# EAGLE design small_analyzer (EAGLE 6.4)
DATABASE: ~/research/analoglab/asthma/eagle/digikeydb.txt
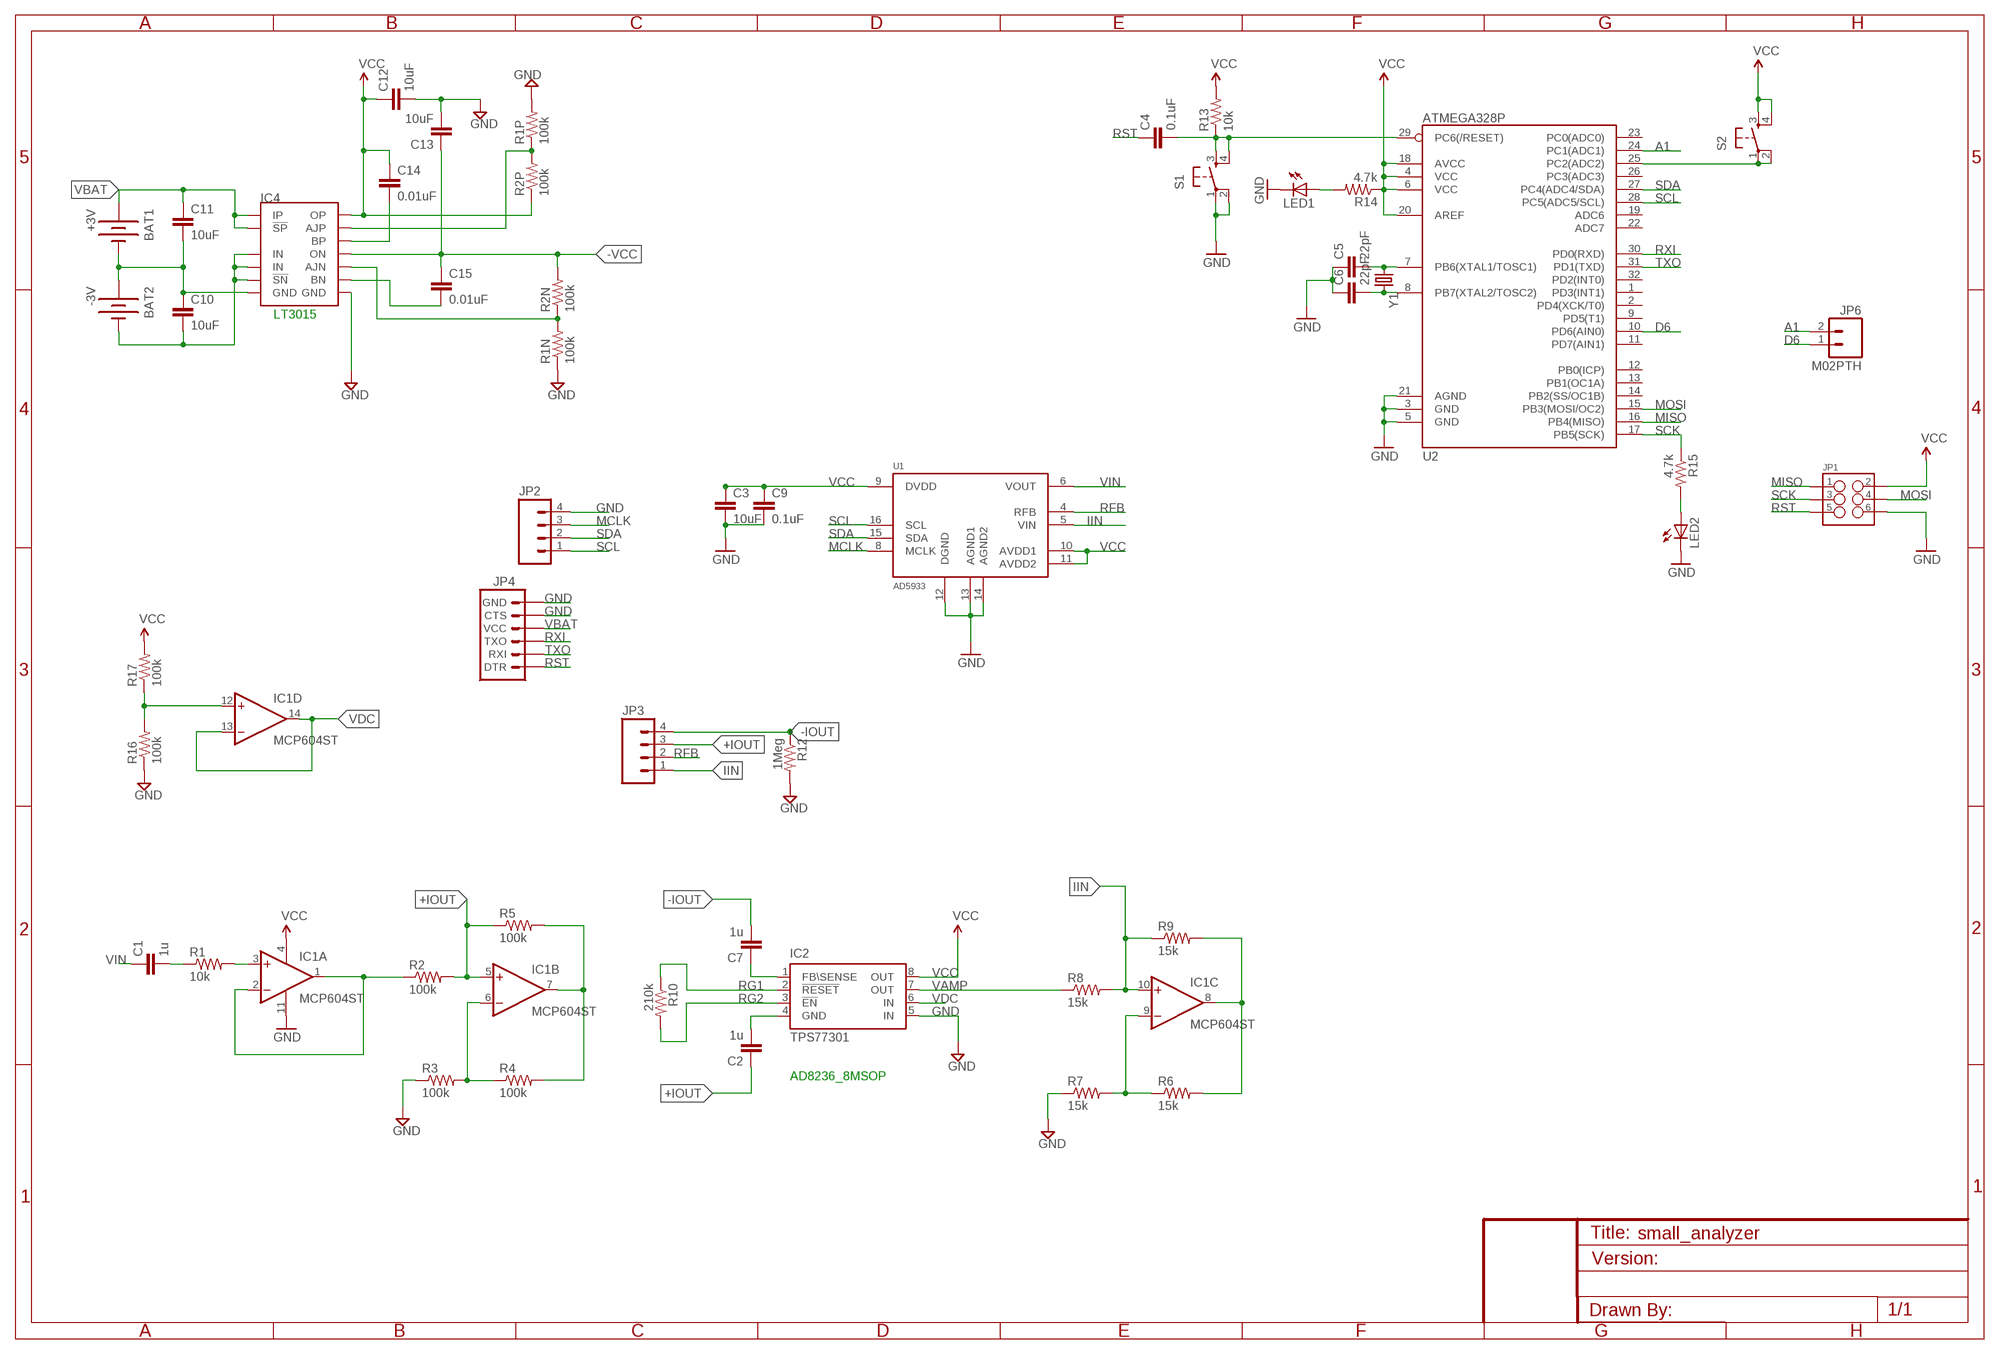
[diagram p0: schematic, sheet 1]

## Parts
BAT1  +3V  BATTERY12MM  [BATTCON_12MM]
BAT2  -3V  BATTERY12MM  [BATTCON_12MM]
C1  1u  CAP0603-CAP  [0603-CAP]
C2  1u  CAP0603-CAP  [0603-CAP]
C3  10uF  CAP0603-CAP  [0603-CAP]
C4  0.1uF  CAP0805  [0805]
C5  22pF  CAP0805  [0805]
C6  22pF  CAP0805  [0805]
C7  1u  CAP0603-CAP  [0603-CAP]
C9  0.1uF  CAP0603-CAP  [0603-CAP]
C10  10uF  CAP0603-CAP  [0603-CAP]
C11  10uF  CAP0603-CAP  [0603-CAP]
C12  10uF  CAP0603-CAP  [0603-CAP]
C13  10uF  CAP0603-CAP  [0603-CAP]
C14  0.01uF  CAP0603-CAP  [0603-CAP]
C15  0.01uF  CAP0603-CAP  [0603-CAP]
IC1  MCP604ST  [TSSOP14]
IC2  TPS77301  [SOP-08]
IC4  LT3032  [DFN14-4X3DE]
JP1  M03X2NO_SILK  [2X3-NS]
JP2  M04PTH  [1X04]
JP3  M04PTH  [1X04]
JP4  ARDUINO_SERIAL_PROGRAMLOCK  [1X06_LOCK]
JP6  M02PTH  [1X02]
LED1  LED0603  [LED-0603]
LED2  LED0603  [LED-0603]
R1  10k  RESISTOR0603-RES  [0603-RES]
R1N  100k  RESISTOR0805-RES  [0805]
R1P  100k  RESISTOR0805-RES  [0805]
R2  100k  RESISTOR0603-RES  [0603-RES]
R2N  100k  RESISTOR0805-RES  [0805]
R2P  100k  RESISTOR0805-RES  [0805]
R3  100k  RESISTOR0603-RES  [0603-RES]
R4  100k  RESISTOR0603-RES  [0603-RES]
R5  100k  RESISTOR0603-RES  [0603-RES]
R6  15k  RESISTOR0603-RES  [0603-RES]
R7  15k  RESISTOR0603-RES  [0603-RES]
R8  15k  RESISTOR0603-RES  [0603-RES]
R9  15k  RESISTOR0603-RES  [0603-RES]
R10  210k  RESISTOR0603-RES  [0603-RES]
R12  1Meg  RESISTOR0603-RES  [0603-RES]
R13  10k  RESISTOR0805-RES  [0805]
R14  4.7k  RESISTOR0805-RES  [0805]
R15  4.7k  RESISTOR0805-RES  [0805]
R16  100k  RESISTOR0805-RES  [0805]
R17  100k  RESISTOR0805-RES  [0805]
S1  TAC_SWITCHSMD  [TACTILE_SWITCH_SMD]
S2  TAC_SWITCHSMD  [TACTILE_SWITCH_SMD]
U1  AD5933  [SSOP16]
U2  ATMEGA328P  ATMEGA328_SMT  [TQFP32-08]
Y1  CRYSTAL5X3  [CRYSTAL-SMD-5X3]

## Nets
+IOUT: C2.1 IC1.5(B:+IN) JP3.3 R2.2 R5.1
-IOUT: C7.2 JP3.4 R12.1
-VCC: C13.1 C15.1 IC4.7(ON) R2N.2
A1: JP6.2 U2.24(PC1(ADC1))
D6: JP6.1 U2.10(PD6(AIN0))
GND: C3.2 C5.1 C6.1 C9.2 C12.2 C13.2 IC1.11(P:V-) IC2.5(IN) IC4.5(GND) JP1.6 JP2.4 JP4.5(CTS) JP4.6(GND) LED1.C LED2.C R1N.1 R1P.2 R3.1 R7.1 R12.2 R16.1 S1.1 S1.2 U1.12(DGND) U1.13(AGND1) U1.14(AGND2) U2.3(GND) U2.5(GND) U2.21(AGND)
IIN: IC1.10(C:+IN) JP3.1 R8.2 R9.1 U1.5(VIN)
MCLK: JP2.3 U1.8(MCLK)
MISO: JP1.1 U2.16(PB4(MISO))
MOSI: JP1.4 U2.15(PB3(MOSI/OC2))
N$1: C1.2 R1.1
N$2: IC1.3(A:+IN) R1.2
N$3: IC1.1(A:OUT) IC1.2(A:-IN) R2.1
N$4: C5.2 U2.7(PB6(XTAL1/TOSC1)) Y1.1
N$5: IC1.6(B:-IN) R3.2 R4.1
N$6: IC1.7(B:OUT) R4.2 R5.2
N$7: IC1.8(C:OUT) R6.2 R9.2
N$8: IC1.9(C:-IN) R6.1 R7.2
N$9: C6.2 U2.8(PB7(XTAL2/TOSC2)) Y1.3
N$10: LED2.A R15.2
N$11: C4.2 R13.1 S1.3 S1.4 U2.29(PC6(/RESET))
N$12: LED1.A R14.2
N$14: BAT1.GND(-) BAT2.PWR@1(+) C10.1 C11.2 IC4.4(GND)
N$15: IC1.12(D:+IN) R16.2 R17.1
N$16: S2.1 S2.2 U2.25(PC2(ADC2))
N$19: BAT2.GND(-) C10.2 IC4.6(IN) IC4.9(IN) IC4.10(!SN)
N$20: C14.2 IC4.3(BP)
N$21: C15.2 IC4.11(BN)
N$22: IC4.8(AJN) R1N.2 R2N.1
N$23: IC4.2(AJP) R1P.1 R2P.2
N$24: C7.1 IC2.1(FB\SENSE)
N$25: C2.2 IC2.4(GND)
RFB: JP3.2 U1.4(RFB)
RG1: IC2.2(!RESET) R10.1
RG2: IC2.3(!EN) R10.2
RST: C4.1 JP1.5 JP4.1(DTR)
RXI: JP4.3(TXO) U2.30(PD0(RXD))
SCK: JP1.3 R15.1 U2.17(PB5(SCK))
SCL: JP2.1 U1.16(SCL) U2.28(PC5(ADC5/SCL))
SDA: JP2.2 U1.15(SDA) U2.27(PC4(ADC4/SDA))
TXO: JP4.2(RXI) U2.31(PD1(TXD))
VAMP: IC2.7(OUT) R8.1
VBAT: BAT1.PWR@1(+) C11.1 IC4.12(!SP) IC4.14(IP) JP4.4(VCC)
VCC: C3.1 C9.1 C12.1 C14.1 IC1.4(P:V+) IC2.8(OUT) IC4.1(OP) JP1.2 R2P.1 R13.2 R14.1 R17.2 S2.3 S2.4 U1.9(DVDD) U1.10(AVDD1) U1.11(AVDD2) U2.4(VCC) U2.6(VCC) U2.18(AVCC) U2.20(AREF)
VDC: IC1.13(D:-IN) IC1.14(D:OUT) IC2.6(IN)
VIN: C1.1 U1.6(VOUT)
Unconnected: U2.1(PD3(INT1)) U2.2(PD4(XCK/T0)) U2.9(PD5(T1)) U2.11(PD7(AIN1)) U2.12(PB0(ICP)) U2.13(PB1(OC1A)) U2.14(PB2(SS/OC1B)) U2.19(ADC6) U2.22(ADC7) U2.23(PC0(ADC0)) U2.26(PC3(ADC3)) U2.32(PD2(INT0))

## Notes on the sheet
- LT3015
- AD8236_8MSOP

## Library data of the parts
BAT1 BAT2 = SparkFun-Electromechanical:BATTERY: Battery Holders Various common sizes : AA, AAA, 20mm coin cell and 12mm coin cell. 20MM_4LEGS, BATT-10373
C1-C7 C9-C15 = SparkFun-Passives:CAP: Capacitor Standard 0603 ceramic capacitor, and 0.1" leaded capacitor.
IC1 = linear:MCP604: Quad Op Amp 2.7V to 6.0V Single Supply CMOS Source: http://ww1.microchip.com/downloads/en/DeviceDoc/21314g.pdf
IC2 = texas:TPS773*: 250-mA LDO REGULATORS WITH RESET OUTPUT WITH 8-PIN MSOP PACKAGING Source: http://focus.ti.com/lit/ds/symlink/tps77333.pdf; MF: TEXAS INSTRUMENT CONNECTORS; MPN: TPS77301DGK; OC_FARNELL: 1510194; OC_NEWARK: 77C1213
IC4 = AWJLEagleLib:LT3032: LT3032 dual postive/negative LDO linear regulator
JP1 = SparkFun-Connectors:M03X2: 2x3 .1" header. Shrouded, with keying- CONN-10681 SMT- CONN-11415 Pogo pins- HW-11044
JP2 JP3 = SparkFun-Connectors:M04: Header 4 Standard 4-pin 0.1" header. Use with straight break away headers (SKU : PRT-00116), right angle break away headers (PRT-00553), swiss pins (PRT-00743), machine pins (PRT-00117), and female headers (PRT-00115). Molex polarized connector foot print use with SKU : PRT-08231 with associated crimp pins and housings. 1MM SMD Version SKU: PRT-10208
JP4 = SparkFun-Connectors:ARDUINO_SERIAL_PROGRAM: FTDI connector footprints
JP6 = SparkFun-Connectors:M02: Standard 2-pin 0.1" header. Use with - straight break away headers ( PRT-00116) - right angle break away headers (PRT-00553) - swiss pins (PRT-00743) - machine pins (PRT-00117) - female headers (PRT-00115) Molex polarized connector foot print use with: PRT-08233 with associated crimp pins and housings. 2.54_SCREWTERM for use with PRT-10571. 3.5mm Screw Terminal footprints for PRT-08084 5mm Screw Terminal footprints for use with PRT-08433
LED1 LED2 = SparkFun-LED:LED: LEDs Standard schematic elements and footprints for 5mm, 3mm, 1206, and 0603 sized LEDs. 5mm - Spark Fun Electronics SKU : COM-00529 (and others)
R1 R1N R1P R2 R2N R2P R3-R10 R12-R17 = SparkFun-Passives:RESISTOR: Resistor Basic schematic elements and footprints for 0603, 1206, and PTH resistors.
S1 S2 = SparkFun-Electromechanical:TAC_SWITCH: Momentary Switch Button commonly used for reset or general input. Spark Fun Electronics SKU : COM-00097 SMT- SWCH-08247; PROD_ID: SWCH-08247
U1 = kblom:AD5933: 1 MSPS, 12-Bit Impedance Converter, Network Analyzer Applications: Electrochemical analysis Bioelectrical impedance analysis Impedance spectroscopy Complex impedance measurement Corrosion monitoring and protection equipment Biomedical and automotive sensors Proximity sensing Nondestructive testing Material property analysis Fuel/battery cell condition monitoring source <http://www.analog.com/static/imported-files/data_sheets/AD5933.pdf>
U2 = SparkFun-DigitalIC:ATMEGA328_SMT: 32-Pin Atmega328 part Commonly used on Arduino compatible boards Available in QFP and QFN packages TQFP is IC-09069 QFN is non-stock; PROD_ID: IC-09069
Y1 = SparkFun-FreqCtrl:CRYSTAL: Various standard crystals. Proven footprints. Spark Fun Electronics SKU : COM-00534

## Net classes
0 default: width 0.305 mm, drill 0.508 mm, clearance 0.254 mm

## Board
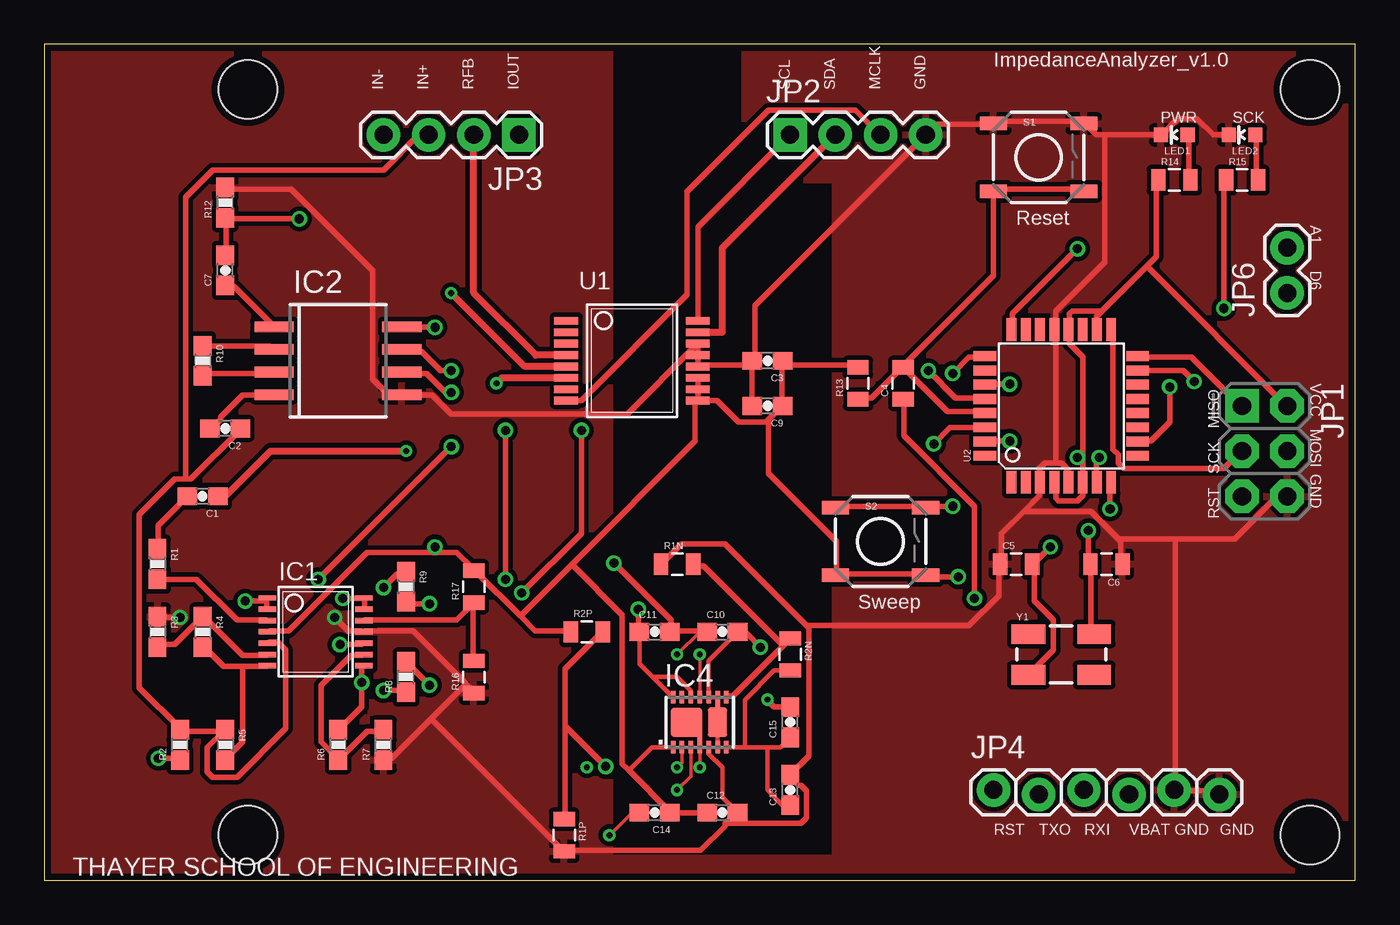
[diagram p1: board, top side]
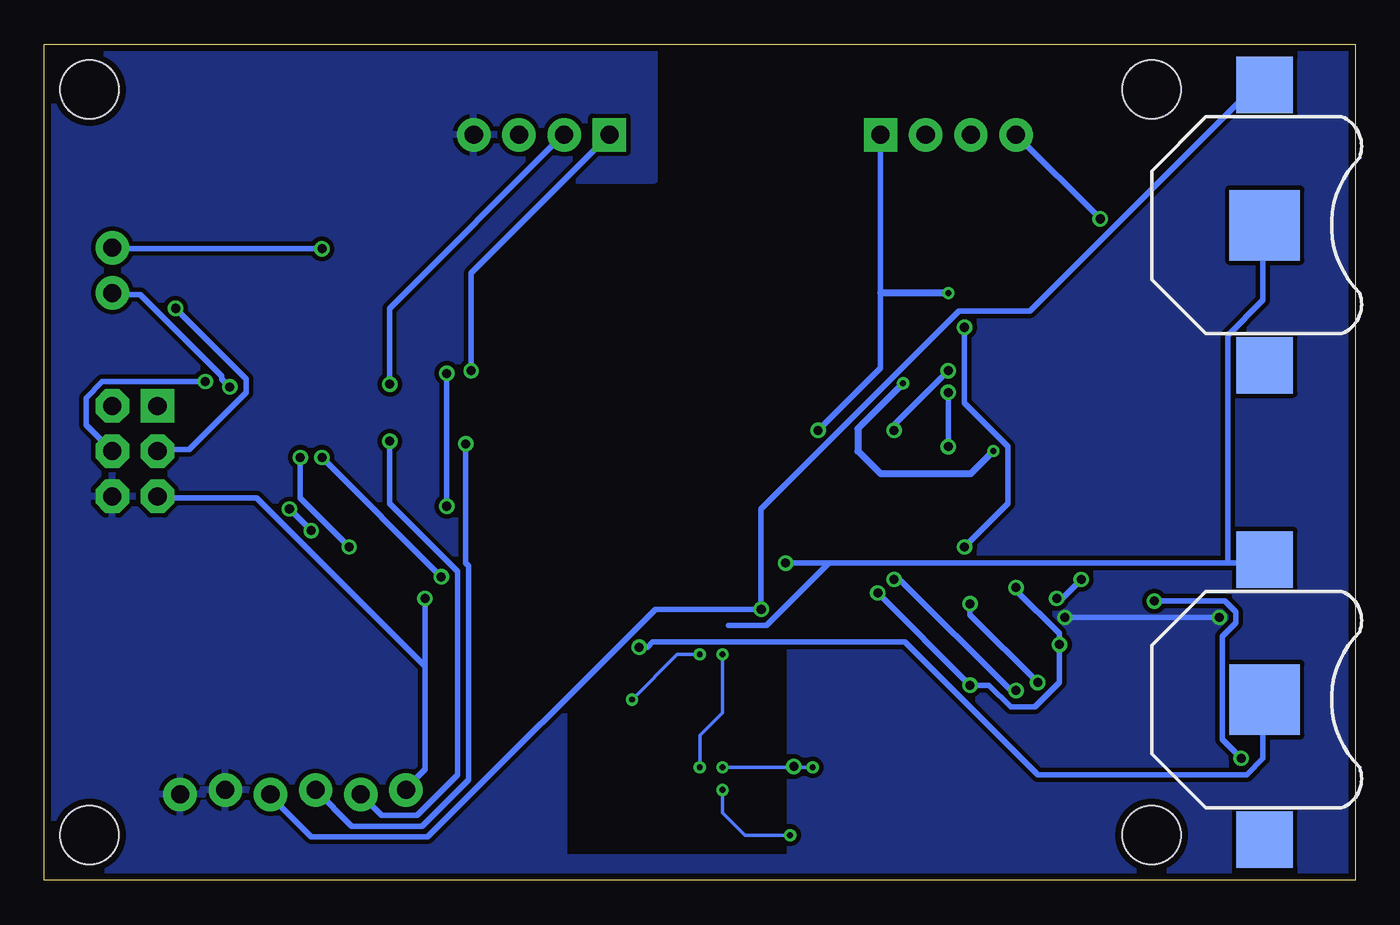
[diagram p2: board, bottom side, seen from below]

Size 73.66 x 46.99 mm. Coordinates in mm from the lower left corner, seen from the top.
Outline: 0,0 73.66,0 73.66,46.99 0,46.99 0,0
Copper layers (1*16): Top 0.0356mm / dielectric 1.5011mm / Bottom 0.0356mm
Design rules "LaenPCBOrder": minimum track width 6mil, minimum drill 13mil, track to track 6mil, track to pad 6mil, pad to pad 6mil, via to via 6mil, smd to smd 6mil, copper to edge 15mil, drill to drill 6mil, minimum pad ring 7mil, minimum via ring 7mil, stop-mask expansion 3mil, vias tented up to drill 0mil, thermal gap 10mil

### Footprints (pad centres in the part's own frame; a part is rotated, then mirrored left to right if it is on the bottom)
BATTCON_12MM = smd 3.962 x 3.962: GND 0,0 | smd 3.175 x 3.175: PWR@1 -7.874,0; PWR@2 7.874,0
0603-CAP = smd 1.1 x 1: 1 -0.85,0; 2 0.85,0
0805 = smd 0.8 x 1.2: 1 -0.9,0; 2 0.9,0
TSSOP14 = smd 0.305 x 0.991: 1 -1.905,-2.718; 2 -1.27,-2.718; 3 -0.635,-2.718; 4 0,-2.718; 5 0.635,-2.718; 6 1.27,-2.718; 7 1.905,-2.718; 8 1.905,2.718; 9 1.27,2.718; 10 0.635,2.718; 11 0,2.718; 12 -0.635,2.718; 13 -1.27,2.718; 14 -1.905,2.718
SOP-08 = smd 0.6 x 2.2: 1 -1.905,-3.6; 2 -0.635,-3.6; 3 0.635,-3.6; 4 1.905,-3.6; 5 1.905,3.575; 6 0.635,3.575; 7 -0.635,3.575; 8 -1.905,3.575
DFN14-4X3DE = smd 0.25 x 0.7: 1 -1.5,-1.4; 2 -1,-1.4; 3 -0.5,-1.4; 5 0.5,-1.4; 6 1,-1.4; 7 1.5,-1.4; 8 1.5,1.4; 10 0.5,1.4; 11 0,1.4; 12 -0.5,1.4; 13 -1,1.4; 14 -1.5,1.4 | smd 0.25 x 2: 4 0,-0.75; 9 1,0.75 | smd 1.75 x 1.65: 4@1 -0.75,0 | smd 1.07 x 1.65: 9@2 1,0
2X3-NS = drill 1.016 pad 1.88 square: 1 -2.54,-1.27 | drill 1.016 pad 1.88 octagon: 2 -2.54,1.27; 3 0,-1.27; 4 0,1.27; 5 2.54,-1.27; 6 2.54,1.27
1X04 = drill 1.016 pad 1.88 square: 1 0,0 | drill 1.016 pad 1.88: 2 2.54,0; 3 5.08,0; 4 7.62,0
1X06_LOCK = drill 1.016 pad 1.88: 1 0,0; 2 2.54,-0.254; 3 5.08,0; 4 7.62,-0.254; 5 10.16,0; 6 12.7,-0.254
1X02 = drill 1.016 pad 1.88: 1 0,0; 2 2.54,0
LED-0603 = smd 0.8 x 0.8: A 0,-0.75; C 0,0.75
0603-RES = smd 1.1 x 1: 1 -0.85,0; 2 0.85,0
TACTILE_SWITCH_SMD = smd 1.524 x 0.762: 1 -2.54,1.905; 2 2.54,1.905; 3 -2.54,-1.905; 4 2.54,-1.905
SSOP16 = smd 0.44 x 1.34: 1 -2.24,-3.7; 2 -1.6,-3.7; 3 -0.96,-3.7; 4 -0.32,-3.7; 5 0.32,-3.7; 6 0.96,-3.7; 7 1.6,-3.7; 8 2.24,-3.7; 9 2.24,3.7; 10 1.6,3.7; 11 0.96,3.7; 12 0.32,3.7; 13 -0.32,3.7; 14 -0.96,3.7; 15 -1.6,3.7; 16 -2.24,3.7
TQFP32-08 = smd 1.27 x 0.559: 1 -4.293,2.8; 2 -4.293,2; 3 -4.293,1.2; 4 -4.293,0.4; 5 -4.293,-0.4; 6 -4.293,-1.2; 7 -4.293,-2; 8 -4.293,-2.8; 17 4.293,-2.8; 18 4.293,-2; 19 4.293,-1.2; 20 4.293,-0.4; 21 4.293,0.4; 22 4.293,1.2; 23 4.293,2; 24 4.293,2.8 | smd 0.559 x 1.27: 9 -2.8,-4.293; 10 -2,-4.293; 11 -1.2,-4.293; 12 -0.4,-4.293; 13 0.4,-4.293; 14 1.2,-4.293; 15 2,-4.293; 16 2.8,-4.293; 25 2.8,4.293; 26 2,4.293; 27 1.2,4.293; 28 0.4,4.293; 29 -0.4,4.293; 30 -1.2,4.293; 31 -2,4.293; 32 -2.8,4.293
STAND-OFF = hole 3.302: 0,0
CRYSTAL-SMD-5X3 = smd 1.9 x 1.1: 1 -1.85,-1.15; 2 1.85,-1.15; 3 1.85,1.15; 4 -1.85,1.15

### Placement (x,y rotation side)
BAT1  5.08,36.83 270 bottom
BAT2  5.08,10.16 270 bottom
C1  8.89,21.59 180 top
C2  10.16,25.4 180 top
C3  40.64,29.21 180 top
C4  48.26,27.94 90 top
C5  54.61,17.78 0 top
C6  59.69,17.78 180 top
C7  10.16,34.29 90 top
C9  40.64,26.67 180 top
C10  38.1,13.97 0 top
C11  34.29,13.97 0 top
C12  38.1,3.81 0 top
C13  41.91,5.08 90 top
C14  34.29,3.81 180 top
C15  41.91,8.89 90 top
IC1  15.24,13.97 270 top
IC2  16.51,29.21 270 top
IC4  36.83,8.89 0 top
JP1  68.58,24.13 270 top
JP2  41.91,41.91 0 top
JP3  26.67,41.91 180 top
JP4  53.34,5.08 0 top
JP6  69.85,33.02 90 top
LED1  63.5,41.91 90 top
LED2  67.31,41.91 90 top
R1  6.35,17.78 270 top
R1N  35.56,17.78 0 top
R1P  29.21,2.54 270 top
R2  7.62,7.62 90 top
R2N  41.91,12.7 270 top
R2P  30.48,13.97 0 top
R3  6.35,13.97 270 top
R4  8.89,13.97 270 top
R5  10.16,7.62 270 top
R6  16.51,7.62 90 top
R7  19.05,7.62 90 top
R8  20.32,11.43 90 top
R9  20.32,16.51 270 top
R10  8.89,29.21 270 top
R12  10.16,38.1 90 top
R13  45.72,27.94 90 top
R14  63.5,39.37 0 top
R15  67.31,39.37 0 top
R16  24.13,11.43 90 top
R17  24.13,16.51 90 top
S1  55.88,40.64 0 top
S2  46.99,19.05 0 top
U1  33.02,29.21 270 top
U2  57.15,26.67 90 top
U$1  [STAND-OFF]  11.43,44.45 0 top
U$2  [STAND-OFF]  11.43,2.54 0 top
U$3  [STAND-OFF]  71.12,2.54 0 top
U$4  [STAND-OFF]  71.12,44.45 0 top
Y1  57.15,12.7 0 top

### Tracks (layer width: path | path; a pad name or v marks a point on that pad's centre or on a via)
+IOUT
  Top 0.305: IC1.5 12.65,13.41 13.11,13.41 13.56,12.95 13.56,8.53 10.82,5.79 9.45,5.79 9.14,6.1 9.14,7.47 10.06,8.38 R5.1 9.91,8.38 7.62,8.38 R2.2 7.62,8.53 5.33,10.82 5.33,20.57 7.32,22.55 7.92,22.55 | 7.92,22.55 8.23,22.55 10.97,25.3 C2.1 | JP3.3 21.03,41.91 19.05,39.93 9.45,39.93 7.92,38.41 7.92,22.55
-IOUT  (via drill 0.51)
  Top 0.305: C7.2 10.21,35.2 10.21,37.19 R12.1 10.36,37.19 v14.33,37.19
  Bottom 0.305: JP3.4 v14.33,37.19
-VCC
  Top 0.254: IC4.7 39.37,7.49 | 39.37,7.49 40.64,7.49 | 40.64,7.49 41.36,7.49 C15.1 | R2N.2 41.01,11.8 39.37,10.16 39.37,7.49 | C13.1 41.49,4.23 40.64,5.08 40.64,7.49
A1  (via drill 0.51)
  Top 0.305: v58.06,35.51 54.41,31.85 54.41,31.09 U2.24
  Bottom 0.305: v58.06,35.51 69.8,35.51 JP6.2
D6  (via drill 0.51)
  Top 0.305: v63.25,27.74 63.25,25.76 62.18,24.69 61.57,24.69 U2.10
  Bottom 0.305: v63.25,27.74 63.7,28.19 63.7,28.35 68.28,32.92 69.8,32.92 JP6.1
GND  (via drill 0.51)
  Top 0.254: IC4.5 37.33,7.12 38.1,6.35 38.1,4.66 C12.2
  Top 0.305: R12.2 10.21,38.86 13.87,38.86 18.44,34.29 18.44,28.19 19.2,27.43 19.96,27.43 IC2.5 20.12,27.28 21.79,27.28 22.86,26.21 32.77,26.21 36.58,30.02 U1.14 36.73,30.02 36.73,29.57 U1.13 36.73,29.41 36.73,28.96 U1.12 36.88,28.96 39.78,28.96 | 59.59,41.91 59.13,41.91 58.52,42.52 S1.2 58.37,42.67 53.34,42.67 S1.1 53.34,42.52 50.14,42.52 JP2.4 39.93,32.31 39.93,29.26 C3.2 | 59.59,41.91 LED1.C 62.79,41.91 63.7,42.82 64.77,42.82 65.68,41.91 LED2.C | 39.78,28.96 39.78,29.11 C3.2 | 39.78,28.96 39.78,26.67 C9.2 | 39.78,28.96 C3.2 | 23.7,11.05 24.08,10.67 R16.1 24.23,10.52 | 23.7,11.05 20.73,14.02 17.98,14.02 IC1.11 17.83,14.02 17.07,14.02 v16.31,14.78 | v7.62,14.78 6.4,14.78 R3.1 | 23.7,11.05 21.72,9.07 | 21.72,9.07 19.51,6.86 19.05,6.86 R7.1 | JP4.6 65.84,5.03 63.55,5.03 JP4.5 63.55,5.18 63.55,19.2 | 55.09,20.8 55.93,21.64 55.93,22.25 U2.3 55.93,22.4 55.93,23.16 56.24,23.47 56.84,23.47 | 55.09,20.8 53.8,19.51 53.8,17.83 C5.1 53.65,17.68 53.65,16 51.97,14.33 42.98,14.33 42.9,14.25 | 60.43,19.13 58.83,20.73 55.17,20.73 55.09,20.8 | 60.43,19.13 60.5,19.05 60.5,17.83 C6.1 | 56.84,23.47 57.15,23.47 57.45,23.16 57.45,22.4 U2.5 | 56.84,23.47 56.84,30.94 U2.21 56.84,31.09 56.84,32 59.59,34.75 59.59,41.91 | 63.55,19.2 60.5,19.2 60.43,19.13 | 63.55,19.2 66.9,19.2 69.19,21.49 69.8,21.49 JP1.6 | 38.33,3.28 38.25,3.2 38.25,3.05 36.88,1.68 29.26,1.68 R1P.2 29.11,1.68 21.72,9.07 | 38.33,3.28 38.86,3.81 C12.2 | 38.33,3.28 38.41,3.2 42.52,3.2 42.82,3.5 42.82,5.03 42.52,5.33 42.37,5.33 41.91,5.79 C13.2 41.91,5.94 42.98,7.01 42.98,14.17 42.9,14.25 | 42.9,14.25 38.25,18.9 35.81,18.9 34.75,17.83 R1N.1
  Bottom 0.305: v16.31,14.78 v7.62,14.78
  pour Bottom: 0,46.99 30.48,46.99 31.75,46.99 31.75,1.27 44.45,1.27 44.45,39.37 39.37,39.37 39.37,46.99 73.66,46.99 73.66,0 0,0
  pour Top: 0,46.99 31.75,46.99 31.75,1.27 44.45,1.27 44.45,39.37 39.37,39.37 39.37,46.99 73.66,46.99 73.66,0 0,0
IIN  (via drill 0.33, 0.51)
  Top 0.305: v16.61,13.26 17.83,13.26 IC1.10 | v19.05,16.46 19.81,17.22 20.27,17.22 R9.1 | v21.64,10.97 20.42,12.19 R8.2 | v30.18,25.3 30.18,19.51 v26.82,16.15
  Top 0.406: U1.5 26.99,28.89 v22.86,33.02
  Bottom 0.305: v19.05,16.46 19.05,16.31 16.61,13.87 v16.61,13.26 16.61,11.12 17.98,9.75 19.36,9.75 20.57,10.97 v21.64,10.97 v26.82,16.15 | JP3.1 26.67,33.02 26.67,28.8 v30.18,25.3
  Bottom 0.406: v22.86,33.02 26.67,33.02
MCLK
  Top 0.305: U1.8 29.41,26.98 30.18,26.98 36.12,32.92 36.12,38.71 40.69,43.28 45.57,43.28 46.94,41.91 JP2.3
MISO
  Top 0.305: U2.16 61.57,29.41 64.47,29.41 67.21,26.67 JP1.1
MOSI  (via drill 0.51)
  Top 0.305: v64.62,28.04 64.01,28.65 61.57,28.65 U2.15
  Bottom 0.305: v64.62,28.04 70.41,28.04 71.32,27.13 71.32,25.6 JP1.4
N$1
  Top 0.305: R1.1 6.4,18.75 6.4,19.96 7.92,21.49 C1.2
N$2
  Top 0.305: IC1.3 12.5,14.63 10.82,14.63 8.53,16.92 6.4,16.92 R1.2
N$3  (via drill 0.51)
  Top 0.305: 12.5,15.7 12.5,15.85 IC1.1 | 12.5,15.7 12.5,15.24 IC1.2 | v6.4,6.86 7.62,6.86 R2.1 | 12.5,15.7 v11.28,15.7
  Bottom 0.305: v6.4,6.86 7.47,7.92 7.47,13.72 6.71,14.48 6.71,15.09 7.32,15.7 v11.28,15.7
N$4  (via drill 0.51)
  Top 0.305: Y1.1 55.32,11.58 56.69,12.95 56.69,14.63 55.63,15.7 55.63,17.68 C5.2 55.63,17.83 v56.54,18.75 | v59.28,23.77 59.13,23.62 59.13,22.4 U2.7
  Bottom 0.305: v59.28,23.77 59.28,21.49 v56.54,18.75
N$5
  Top 0.305: IC1.6 12.5,12.65 11.12,12.65 8.99,14.78 R4.1 8.84,14.78 7.32,13.26 6.4,13.26 R3.2
N$6
  Top 0.305: 11.12,12.04 10.06,12.04 8.99,13.11 R4.2 | 11.12,12.04 12.5,12.04 IC1.7 | 11.12,12.04 11.12,7.77 10.21,6.86 R5.2
N$7  (via drill 0.51)
  Top 0.305: IC1.8 17.83,12.04 v17.83,11.12 17.83,9.75 16.61,8.53 R6.2 | v21.64,15.54 20.42,15.54 R9.2
  Bottom 0.305: v21.64,15.54 21.64,14.94 v17.83,11.12
N$8
  Top 0.305: IC1.9 17.83,12.65 17.22,12.65 15.54,10.97 15.54,7.77 16.46,6.86 R6.1 16.61,6.86 18.14,8.38 19.05,8.38 R7.2
N$9  (via drill 0.51)
  Top 0.305: Y1.3 58.98,13.87 58.83,14.02 58.83,17.68 C6.2 58.67,17.83 v58.67,19.66 | v59.89,20.88 59.89,22.25 U2.8
  Bottom 0.305: v58.67,19.66 v59.89,20.88
N$10
  Top 0.305: LED2.A 68.12,41.91 68.12,39.47 R15.2
N$11
  Top 0.305: S1.4 58.37,38.86 53.34,38.86 S1.3 53.34,33.98 48.31,28.96 C4.2 | R13.1 45.72,27.13 46.48,27.13 48.16,28.8 C4.2 | U2.29 52.73,26.36 50.75,26.36 48.31,28.8 C4.2
N$12
  Top 0.305: LED1.A 64.31,41.91 64.31,39.47 R14.2
N$14  (via drill 0.33, 0.51)
  Top 0.203: C10.1 36.83,13.97 v35.56,12.7 | IC4.4 v36.83,6.35
  Top 0.305: C10.1 37.19,14.02 35.2,14.02 C11.2 35.2,14.17 35.2,14.63 v32,17.83
  Bottom 0.203: v35.56,12.7 35.56,9.41 IC4.4 v36.83,6.35
  Bottom 0.305: 7.16,17.83 5.33,17.83 5.18,17.98 BAT2.PWR@1 | 7.16,17.83 29.57,17.83 | 29.57,17.83 v32,17.83 | 7.16,17.83 7.16,30.63 5.18,32.61 5.18,36.73 BAT1.GND | 35.2,14.33 33.07,14.33 29.57,17.83
N$15
  Top 0.305: IC1.12 17.98,14.63 23.16,14.63 24.08,15.54 R17.1 24.08,15.39 24.08,12.34 R16.2
N$16  (via drill 0.51)
  Top 0.305: v51.05,28.5 51.97,29.41 52.73,29.41 U2.25 | 49.53,21.03 v51.05,21.03 | 49.53,21.03 44.5,21.03 S2.1 | 49.53,21.03 S2.2
  Bottom 0.305: v51.05,21.03 v51.05,28.5
N$19  (via drill 0.51)
  Top 0.254: IC4.6 IC4.9 37.83,10.29 IC4.10 37.33,12.35 C10.2
  Top 0.305: 38.86,13.87 C10.2 39.01,13.87 39.47,13.87 v40.23,13.11
  Bottom 0.305: BAT2.GND 5.18,10.06 5.18,6.86 6.1,5.94 17.83,5.94 25.3,13.41 39.47,13.41 39.78,13.11 v40.23,13.11
N$20  (via drill 0.33)
  Top 0.203: IC4.3 36.33,5.85 v35.56,5.08 | C14.2 33.02,3.81 v31.75,2.54
  Bottom 0.203: v35.56,5.08 35.56,3.81 34.29,2.54 v31.75,2.54
N$21  (via drill 0.33)
  Top 0.203: IC4.11 v36.83,12.7
  Top 0.305: C15.2 41.91,9.75 41,9.75 40.69,10.06 v40.64,10.16
  Bottom 0.203: v36.83,12.7 38.1,12.7 v40.64,10.16
N$22
  Top 0.305: IC4.8 38.41,10.36 38.71,10.36 41.91,13.56 R2N.1 41.45,13.26 37.03,17.68 36.58,17.68 R1N.2
N$23  (via drill 0.33, 0.51)
  Top 0.203: IC4.2 35.83,6.62 v35.56,6.35
  Top 0.305: 29.26,8.69 29.26,11.89 31.24,13.87 R2P.2 | 29.26,8.69 29.26,3.5 R1P.1 | 29.26,8.69 v31.55,6.4
  Bottom 0.203: v35.56,6.35 31.55,6.35 30.48,6.35
  Bottom 0.305: v31.55,6.4 31.55,6.35
N$24
  Top 0.305: C7.1 10.21,33.38 10.67,33.38 12.8,31.24 IC2.1
N$25
  Top 0.305: C2.2 9.45,25.45 9.91,25.91 9.91,26.06 11.12,27.28 12.8,27.28 IC2.4
N$26  (via drill 0.33)
  other vias: 30.48,6.35
RFB
  Top 0.406: U1.4 27.62,29.53 24.13,33.02 JP3.2
RG1
  Top 0.305: R10.1 8.99,30.02 12.65,30.02 12.8,29.87 IC2.2
RG2
  Top 0.305: R10.2 8.99,28.5 12.8,28.5 IC2.3
RST  (via drill 0.51)
  Top 0.305: v52.27,15.85 52.27,21.03 48.31,24.99 48.31,26.98 C4.1
  Bottom 0.305: 52.27,12.04 52.27,6.25 53.34,5.18 JP4.1 | 52.27,12.04 v52.27,15.85 | 52.27,12.04 61.72,21.49 67.21,21.49 JP1.5
RXI  (via drill 0.51)
  Top 0.305: v49.99,24.54 50.9,25.45 52.73,25.45 U2.30
  Bottom 0.305: v49.99,24.54 49.99,17.83 49.84,17.68 49.84,5.64 52.43,3.05 56.39,3.05 JP4.3
SCK  (via drill 0.51)
  Top 0.305: v66.29,32.16 66.29,39.32 R15.1 | U2.17 60.05,30.94 60.05,24.23 60.35,23.93 60.35,23.47 60.66,23.16 66.29,23.16 67.21,24.08 JP1.3
  Bottom 0.305: v66.29,32.16 62.33,28.19 62.33,27.43 65.53,24.23 67.21,24.23 JP1.3
SCL  (via drill 0.51)
  Top 0.305: v49.68,28.65 51.21,27.13 52.73,27.13 U2.28 | JP2.1 36.73,36.73 36.73,31.55 U1.16
  Bottom 0.305: v49.68,28.65 49.68,34.14 JP2.1
SDA  (via drill 0.51)
  Top 0.305: v54.25,27.89 52.88,27.89 U2.27
  Top 0.406: U1.15 38.1,30.81 38.1,35.56 JP2.2
  Bottom 0.305: v54.25,27.89 54.25,32.16 44.5,41.91 JP2.2
TXO  (via drill 0.51)
  Top 0.305: v54.25,24.69 52.88,24.69 U2.31
  Bottom 0.305: v54.25,24.69 54.25,21.18 50.44,17.37 50.44,5.94 52.73,3.66 54.71,3.66 JP4.2
VAMP  (via drill 0.51)
  Top 0.305: v19.05,10.67 20.27,10.67 R8.1 | v25.91,25.3 v25.91,16.92 | v22.86,28.65 22.25,28.65 21.18,29.72 20.12,29.72 IC2.7
  Bottom 0.305: v19.05,10.67 19.36,10.67 25.6,16.92 v25.91,16.92 | v25.91,25.3 25.91,25.6 v22.86,28.65
VBAT  (via drill 0.51)
  Top 0.254: C11.1 33.44,12.18 34.24,11.38 | 34.24,11.38 IC4.14 | IC4.12 36.33,10.66 35.56,11.43 34.29,11.43 34.24,11.38
  Top 0.305: v33.38,15.24 33.38,14.02 C11.1
  Bottom 0.305: BAT1.PWR@1 5.18,44.65 5.64,44.65 18.29,32 22.25,32 33.38,20.88 v33.38,15.24 39.32,15.24 52.12,2.44 58.67,2.44 60.96,4.72 JP4.4
VCC  (via drill 0.51)
  Top 0.254: IC4.1 34.16,7.49 32.84,6.17
  Top 0.305: U2.4 56.84,22.25 56.84,21.49 57,21.34 58.06,21.34 58.37,21.64 58.37,22.25 U2.6 58.37,22.4 58.37,23.77 | 59.36,31.93 59.13,31.7 59.13,31.09 U2.18 | 59.36,31.93 61.95,34.52 | 61.95,34.52 62.48,35.05 62.48,39.32 R14.1 | 59.36,31.93 59.28,32 57.76,32 57.61,31.85 57.61,31.09 U2.20 57.61,30.94 57.61,30.18 58.37,29.41 58.37,23.77 | 61.95,34.52 69.8,26.67 JP1.2 | U1.9 36.73,27.58 U1.10 36.73,27.74 36.73,28.19 U1.11 | 41.45,28.96 41.45,29.11 C3.1 41.45,28.96 | 41.45,28.96 41.45,26.67 | 41.45,28.96 45.72,28.96 R13.2 | 41.45,26.67 40.62,25.83 | 40.62,25.83 40.54,25.76 39.01,25.76 37.8,26.98 36.88,26.98 U1.9 | 41.45,26.67 C9.1 | 40.62,25.83 40.69,25.76 40.69,22.86 44.5,19.05 44.5,17.37 S2.3 44.5,17.22 49.53,17.22 S2.4 49.53,17.07 v51.36,17.07 | 21.95,18.44 23.16,18.44 24.08,17.53 R17.2 24.23,17.37 26.75,14.86 | 21.95,18.44 18.14,18.44 13.72,14.02 12.65,14.02 IC1.4 | v21.95,31.09 20.12,31.09 IC2.8 | 21.95,18.44 v21.95,18.75 | 26.75,14.86 27.58,14.02 29.57,14.02 R2P.1 | 26.75,14.86 29.64,17.75 | 29.64,17.75 36.58,24.69 36.58,26.82 U1.9 | v58.06,23.77 58.37,23.77 | C12.1 35.2,3.81 | 29.64,17.75 32.46,14.94 32.46,6.55 32.84,6.17 35.2,3.81 | 35.2,3.81 C14.1
  Bottom 0.305: v51.36,17.07 v58.06,23.77 | v21.95,31.09 21.95,26.82 19.51,24.38 19.51,21.18 v21.95,18.75
VDC  (via drill 0.51)
  Top 0.305: IC1.13 17.98,15.24 17.98,15.85 IC1.14 17.83,15.85 v16.76,15.85 | v22.86,24.38 v15.39,16.92 | v22.86,27.43 22.55,27.43 21.49,28.5 20.12,28.5 IC2.6
  Bottom 0.305: v16.76,15.85 16.46,15.85 v15.39,16.92 | v22.86,27.43 v22.86,24.38
VIN  (via drill 0.33)
  Top 0.406: C1.1 10.16,21.59 12.7,24.13 v20.32,24.13 | U1.6 25.71,28.25 v25.4,27.94
  Bottom 0.406: v25.4,27.94 27.94,25.4 27.94,24.13 26.67,22.86 21.59,22.86 v20.32,24.13

### Text on the board
tPlace: ImpedanceAnalyzer_v1.0 | IN- | IN+ | RFB | IOUT | SCL | SDA | MCLK | GND | PWR | SCK | Reset | A1 | D6 | VCC | MISO | MOSI | SCK | GND | RST | Sweep | RST | TXO | RXI | VBAT | GND | GND | THAYER SCHOOL OF ENGINEERING